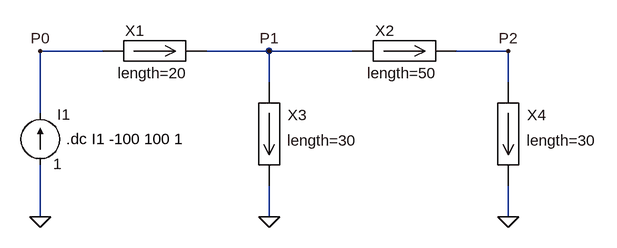
[diagram p0: schematic Example_FlowSweep.asc]
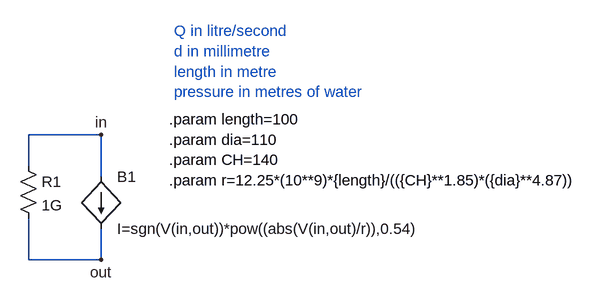
[diagram p1: sub-circuit pipe.asc]
Example_FlowSweep.asc, the LTspice schematic file:
Version 4
SHEET 1 1604 936
WIRE 48 192 -48 192
WIRE 304 192 208 192
WIRE 432 192 304 192
WIRE 672 192 592 192
WIRE 304 240 304 192
WIRE 672 240 672 192
WIRE -48 288 -48 192
WIRE -48 448 -48 368
WIRE 304 448 304 400
WIRE 672 448 672 400
FLAG -48 448 0
FLAG 304 192 P1
FLAG 672 192 P2
FLAG 304 448 0
FLAG 672 448 0
FLAG -48 192 P0
SYMBOL Pipe 128 192 R0
WINDOW 0 -45 -31 Left 2
WINDOW 39 -57 34 Left 2
SYMATTR InstName X1
SYMATTR SpiceLine length=20
SYMBOL Pipe 512 192 R0
WINDOW 0 -45 -31 Left 2
WINDOW 39 -57 34 Left 2
SYMATTR InstName X2
SYMATTR SpiceLine length=50
SYMBOL Pipe 304 320 R90
WINDOW 0 -29 -29 VLeft 2
WINDOW 39 10 -28 VLeft 2
SYMATTR InstName X3
SYMATTR SpiceLine length=30
SYMBOL current -48 368 M180
WINDOW 123 0 0 Left 0
WINDOW 39 0 0 Left 0
WINDOW 0 26 78 Left 2
WINDOW 3 20 2 Left 2
SYMATTR InstName I1
SYMATTR Value 1
SYMBOL Pipe 672 320 R90
WINDOW 0 -29 -29 VLeft 2
WINDOW 39 10 -28 VLeft 2
SYMATTR InstName X4
SYMATTR SpiceLine length=30
TEXT -8 328 Left 2 !.dc I1 -100 100 1

pipe.asc, the sub-circuit schematic file:
Version 4
SHEET 1 1436 680
WIRE 192 80 80 80
WIRE 80 128 80 80
WIRE 192 144 192 80
WIRE 80 272 80 208
WIRE 192 272 192 224
WIRE 192 272 80 272
FLAG 192 80 in
FLAG 192 272 out
SYMBOL res 64 112 R0
SYMATTR InstName R1
SYMATTR Value 1G
SYMBOL bi 192 144 R0
SYMATTR InstName B1
SYMATTR Value I=sgn(V(in,out))*pow((abs(V(in,out)/r)),0.54)
TEXT 304 -80 Left 2 ;Q in litre/second\nd in millimetre\nlength in metre\npressure in metres of water
TEXT 296 56 Left 2 !.param length=100\n.param dia=110\n.param CH=140\n.param r=12.25*(10**9)*{length}/(({CH}**1.85)*({dia}**4.87))

The netlist it stands for:
* Example_FlowSweep.asc
XX1 P0 P1 pipe params: length=20
XX2 P1 P2 pipe params: length=50
XX3 P1 0 pipe params: length=30
I1 0 P0 1
XX4 P2 0 pipe params: length=30

* block symbol definitions
.subckt pipe in out
R1 in out 1G
B1 in out I=sgn(V(in,out))*pow((abs(V(in,out)/r)),0.54)
* Q in litre/second
* d in millimetre
* length in metre
* pressure in metres of water
.param length=100
.param dia=110
.param CH=140
.param r=12.25*(10**9)*{length}/(({CH}**1.85)*({dia}**4.87))
.ends pipe

.dc I1 -100 100 1
.backanno
.end